# EAGLE design whistle-board (EAGLE 7.4.0)
VERSION: 1.0
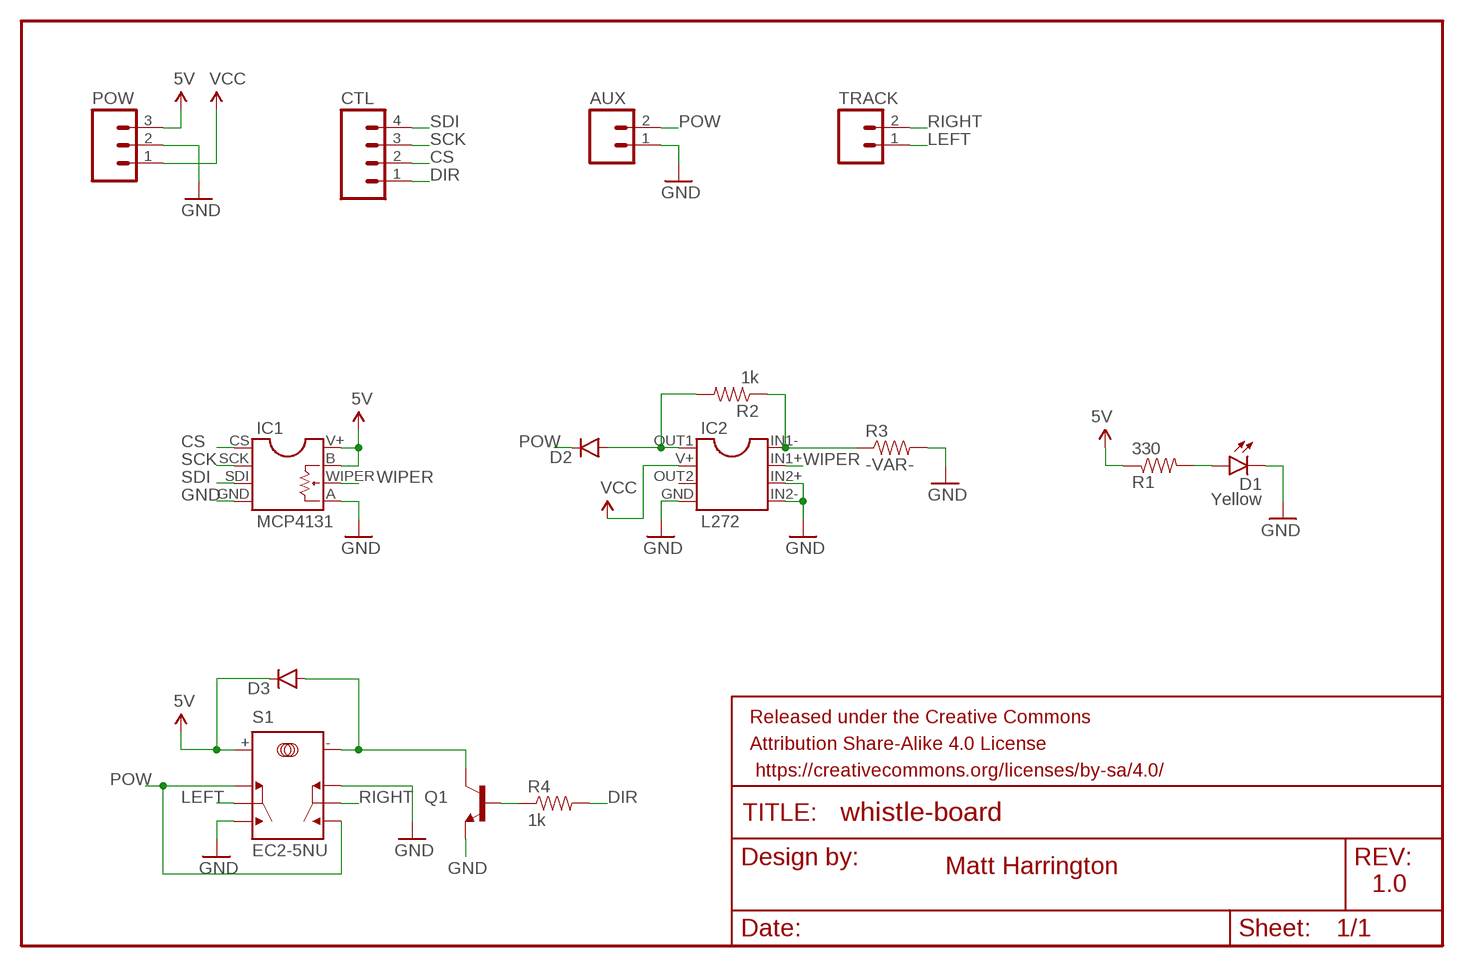
[diagram p0: schematic, sheet 1]

## Parts
AUX  M02PTH  [1X02]
CTL  M04PTH  [1X04]
D1  Yellow  LED-YELLOW0603  [LED-EDGE]
D2  DIODEPTH  [DIODE-1N4001]
D3  DIODE1N4148  [DIODE-1N4148]
FRAME1  FRAME-LETTER  [CREATIVE_COMMONS]
IC1  MCP4131  [MCP4131]
IC2  L272  [L272]
POW  M03PTH  [1X03]
Q1  TRANSISTOR_NPNTO92  [TO-92]
R1  330  1KOHM-1/4W-5%(PTH)  [AXIAL-0.3]
R2  1k  1KOHM-1/4W-5%(PTH)  [AXIAL-0.3]
R3  -VAR-  1KOHM-1/4W-5%(PTH)  [AXIAL-0.3]
R4  1k  1KOHM-1/4W-5%(PTH)  [AXIAL-0.3]
S1  EC2-5NU  [EC2-5NU]
TRACK  M02PTH  [1X02]

## Nets
5V: D3.C IC1.B IC1.V+ POW.3 R1.P$1 S1.+
CS: CTL.2 IC1.CS
DIR: CTL.1 R4.P$2
GND: AUX.1 D1.C IC1.A IC1.GND IC2.GND IC2.IN2+ IC2.IN2- POW.2 Q1.1(E) R3.P$2 S1.NC2 S1.NO1
LEFT: S1.COM1 TRACK.1
N$1: D3.A Q1.3(C) S1.-
N$2: Q1.2(B) R4.P$1
N$3: IC2.IN1- R2.P$1 R3.P$1
N$5: D2.A IC2.OUT1 R2.P$2
N$19: D1.A R1.P$2
POW: AUX.2 D2.C S1.NC1 S1.NO2
RIGHT: S1.COM2 TRACK.2
SCK: CTL.3 IC1.SCK
SDI: CTL.4 IC1.SDI
VCC: IC2.V+ POW.1
WIPER: IC1.WIPER IC2.IN1+
Unconnected: IC2.OUT2

## Notes on the sheet
- Matt Harrington
- 1.0

## Library data of the parts
AUX TRACK = SparkFun-Connectors:M02: Standard 2-pin 0.1" header. Use with - straight break away headers ( PRT-00116) - right angle break away headers (PRT-00553) - swiss pins (PRT-00743) - machine pins (PRT-00117) - female headers (PRT-00115) Molex polarized connector foot print use with: PRT-08233 with associated crimp pins and housings. 2.54_SCREWTERM for use with PRT-10571. 3.5mm Screw Terminal footprints for PRT-08084 5mm Screw Terminal footprints for use with PRT-08432
CTL = SparkFun-Connectors:M04: Header 4 Standard 4-pin 0.1" header. Use with straight break away headers (SKU : PRT-00116), right angle break away headers (PRT-00553), swiss pins (PRT-00743), machine pins (PRT-00117), and female headers (PRT-00115). Molex polarized connector foot print use with SKU : PRT-08231 with associated crimp pins and housings. 1MM SMD Version SKU: PRT-10208
D1 = custom-parts:LED-YELLOW: Yellow SMD LEDs LilyPad 1206- DIO-09909 0603- DIO-09003 "SMART" means more efficient and expensive; PROD_ID: DIO-09003
D2 D3 = SparkFun-DiscreteSemi:DIODE: Diode These are standard reverse protection diodes and small signal diodes. SMA package can handle up to about 1A. SOD-323 can handle about 200mA. What the SOD-323 package when ordering, there are some mfgs out there that are 5-pin packages.
FRAME1 = SparkFun-Aesthetics:FRAME-LETTER: Schematic Frame Standard 8.5x11 US Letter frame
IC1 = custom-parts:MCP4131
IC2 = custom-parts:L272
POW = SparkFun-Connectors:M03: Header 3 Standard 3-pin 0.1" header. Use with straight break away headers (SKU : PRT-00116), right angle break away headers (PRT-00553), swiss pins (PRT-00743), machine pins (PRT-00117), and female headers (PRT-00115). Molex polarized connector foot print use with SKU : PRT-08232 with associated crimp pins and housings.
Q1 = custom-parts:TRANSISTOR_NPN: Generic NPN BJT MMBT2222A - TRANS-08049 (SOT-23, 1A 40V) MPSA42 - TRANS-09116 (SOT-23, 500mA 300V) MMBT5088LT1G - TRANS-11160 (SOT-23, 50 mA 30V) BC547 - COM-08928 <http://www.sparkfun.com/products/8928> (TO-92 45V 100mA) (1.Collector 2.Base 3.Emitter) 2N3904 - COM-00521 <http://www.sparkfun.com/products/521> (TO-92 40V 200mA) (1.Emitter 2.Base 3.Collector) P2N2222A - COM-12852 <http://www.sparkfun.com/products/12852> (TO-92 40V 600mA) (1.Collector 2.Base 3.Emitter)
R1-R4 = SparkFun-Resistors:1KOHM-1/4W-5%(PTH): RES-08380; PROD_ID: RES-08380; VALE: 1k
S1 = custom-parts:EC2-5NU

## Board
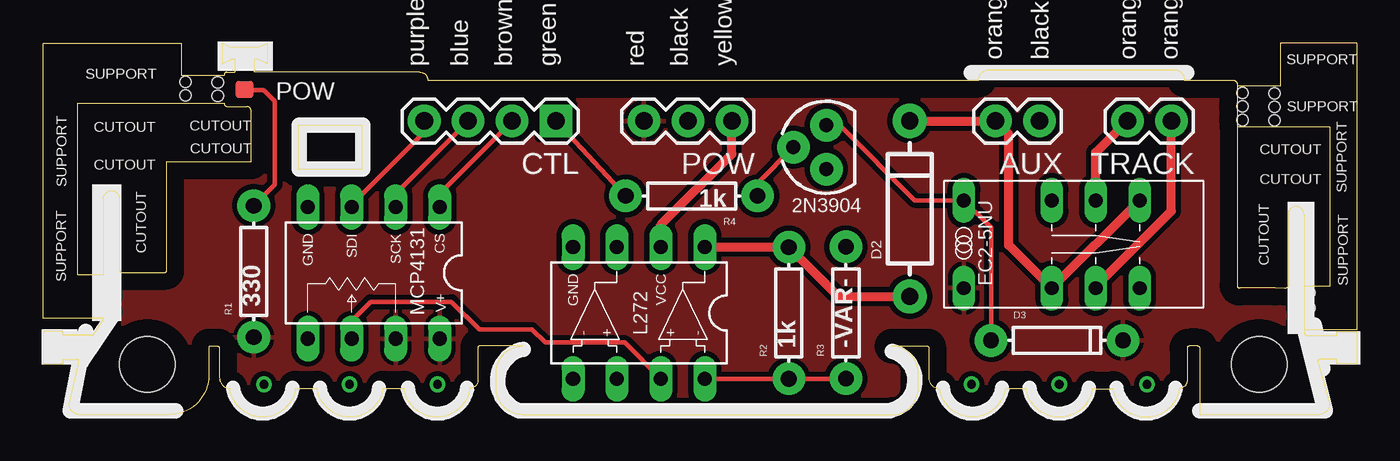
[diagram p1: board, top side]
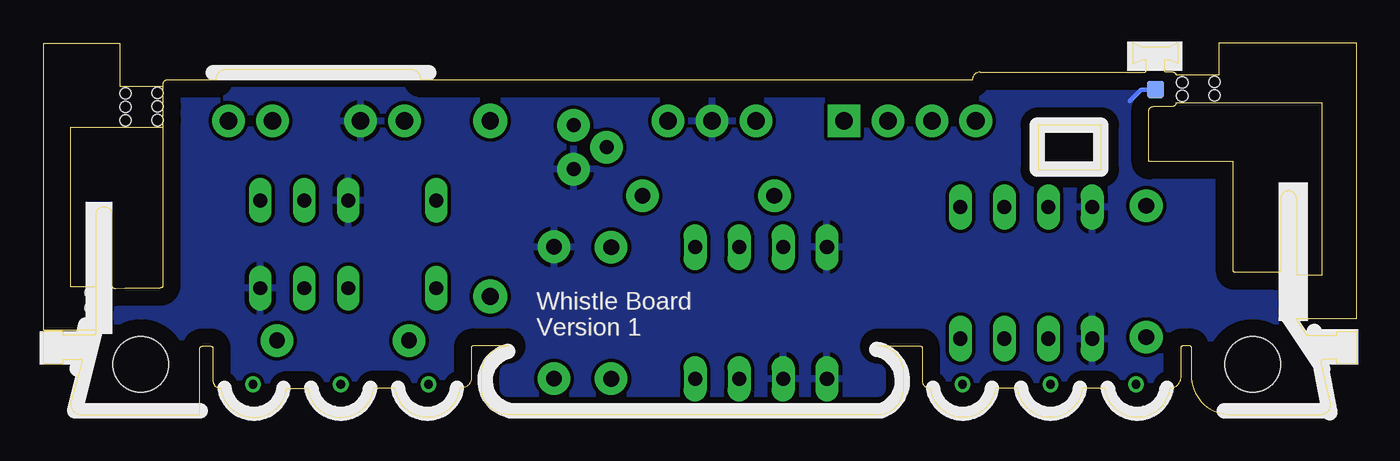
[diagram p2: board, bottom side, seen from below]

Size 75.92 x 21.65 mm. Coordinates in mm from the lower left corner, seen from the top.
Outline: 69.01,19.16 69.01,19.26 arc90 68.76,19.52 65.96,19.52 arc90 65.35,20.13 54.69,20.13 arc90 54.08,19.52 22.22,19.52 arc90 21.77,19.97 12.25,19.97 arc-90 12.19,20.03 12.19,20.67 arc-90 12.23,20.71 12.43,20.71 12.89,20.48 arc117 12.94,20.52 12.94,21.63 arc117 12.92,21.65 12.43,21.41 10.85,21.41 10.38,21.64 arc117 10.34,21.62 10.34,20.51 arc117 10.39,20.48 10.85,20.71 11.06,20.71 arc-90 11.1,20.67 11.1,20.03 arc-90 11.04,19.97 10.61,19.97 arc90 10.46,19.82 10.46,19.8 7.98,19.8 7.98,21.65 0,21.65 0,5.72 3.48,5.72 3.48,5.65
Outline: 69.01,19.16 69.01,16.8
Outline: 69.01,16.8 69.01,7.63 arc90 69.16,7.48 71.2,7.48 71.74,7.47 arc101 71.96,7.65 71.96,11.74 arc-90 72.42,12.2 arc-90 72.87,11.74 72.87,7.58
Outline: 73.66,3.23 74.35,0.77 arc-90 73.74,0.16 66.88,0.16 66.88,3.96 arc90 66.72,4.12 66.23,4.12 arc90 66.12,4.01 66.12,2.14 arc-90 65.66,1.68
Outline: 3.48,5.66 arc-34 3.47,5.63 2.91,4.8 arc-56 2.79,4.73 1.17,4.73 arc-90 1.14,4.76 1.14,4.9 arc90 1.09,4.96 0.06,4.96 arc90 0,4.9 0,3.16 arc90 0.06,3.11 1.09,3.11 arc90 1.14,3.16 1.14,3.33 arc-90 1.18,3.36 1.91,3.36 arc-103 2.06,3.16 1.5,0.77 arc90 2.11,0.16 7.29,0.16 arc90 9.58,2.45 9.58,4.07 arc-90 9.63,4.12 10.07,4.12 arc-90 10.19,4.01 10.19,2.29 arc90 10.79,1.68
Outline: 14.58,1.68 15.82,1.68
Outline: 19.63,1.68 20.85,1.68
Outline: 24.66,1.68 arc90 25.12,2.14 25.12,4.05 arc-90 25.19,4.12 27.71,4.12 arc90 26.19,2.6 26.19,1.68 arc90 27.71,0.16 49.05,0.16 arc90 50.57,1.68 50.57,2.6 arc90 49.05,4.12 51.11,4.12 arc-90 51.18,4.05 51.18,2.29 arc90 51.79,1.68
Outline: 55.6,1.68 56.82,1.68
Outline: 60.63,1.66 61.85,1.66
Outline: 14.58,1.68 arc-165 10.78,1.68
Outline: 19.63,1.68 arc-165 15.83,1.68
Outline: 24.66,1.68 arc-165 20.86,1.68
Outline: 55.6,1.68 arc-165 51.81,1.68
Outline: 60.63,1.66 arc-165 56.82,1.68
Outline: 65.66,1.68 arc-165 61.84,1.66
Outline: 72.87,7.58 72.87,5.06
Outline: 72.87,5.06 72.87,4.94 arc90 73.08,4.73 73.13,4.73 74.75,4.73 arc90 74.78,4.76 74.78,4.9 arc-90 74.83,4.96 75.86,4.96 arc-90 75.92,4.9 75.92,3.16 arc-90 75.86,3.11 74.83,3.11 arc-90 74.78,3.16 74.78,3.33 arc90 74.74,3.36 73.79,3.36 arc90 73.66,3.23
Outline: 72.87,7.58 74.35,7.58 74.35,16.8 69.01,16.8
Outline: 72.87,5.06 75.92,5.06 75.92,21.65 71.5,21.65 71.5,19.16 69.01,19.16
Outline: 3.48,12.66 arc-90 3.94,13.11 arc-90 4.39,12.66 4.39,8.56 arc101 4.61,8.38 5.16,8.39 7.04,8.39 arc90 7.14,8.49 7.14,14.79 12.01,14.79 12.01,17.74 arc90 11.76,17.99 10.63,17.99 arc-90 10.46,18.15 10.46,18.19 2.01,18.19 2.01,8.24 3.48,8.24 3.48,12.66
Outline: 14.76,16.92 18.41,16.92 18.41,14.33 14.76,14.33 14.76,16.92
Copper layers (1*16): Top 0.035mm / dielectric 1.5mm / Bottom 0.035mm
Design rules "default": minimum track width 10mil, minimum drill 24mil, track to track 8mil, track to pad 8mil, pad to pad 8mil, via to via 8mil, smd to smd 8mil, copper to edge 40mil, drill to drill 8mil, minimum pad ring 10mil, minimum via ring 8mil, stop-mask expansion 4mil, vias tented up to drill 0mil, thermal gap 10mil
Holes 3.2 mm at 70.28,3.06 6.02,3.06
Holes 0.64 mm at 3.23,7.88 3.23,6.99 3.23,6.1 10.08,19.39 10.08,18.6 8.23,19.41 8.23,18.63 73.18,7.22 73.18,6.33 73.18,5.44 71.17,18.75 71.17,17.97 69.32,18.78 69.32,17.99 71.17,17.18 69.32,17.2

### Footprints (pad centres in the part's own frame; a part is rotated, then mirrored left to right if it is on the bottom)
1X02 = drill 1.016 pad 1.88: 1 0,0; 2 2.54,0
1X04 = drill 1.016 pad 1.88 square: 1 0,0 | drill 1.016 pad 1.88: 2 2.54,0; 3 5.08,0; 4 7.62,0
LED-EDGE = smd 1 x 1 bottom: A 0,0.012 | smd 1 x 1: C 0,0.013
DIODE-1N4001 = drill 1 pad 1.981: A -5.08,0; C 5.08,0
DIODE-1N4148 = drill 0.9 pad 1.88: A -3.81,0; C 3.81,0
MCP4131 = drill 0.813 long: A 3.81,3.81; B -1.27,3.81; CS -3.81,-3.81; GND 3.81,-3.81; SCK -1.27,-3.81; SDI 1.27,-3.81; V+ -3.81,3.81; WIPER 1.27,3.81
L272 = drill 0.813 long: GND 3.81,-3.81; IN1+ -1.27,3.81; IN1- -3.81,3.81; IN2+ 1.27,3.81; IN2- 3.81,3.81; OUT1 -3.81,-3.81; OUT2 1.27,-3.81; V+ -1.27,-3.81
1X03 = drill 1.016 pad 1.88: 1 0,0; 2 2.54,0; 3 5.08,0
TO-92 = drill 0.813 pad 1.88: 1 -1.27,0; 2 0,1.905; 3 1.27,0
AXIAL-0.3 = drill 0.9 pad 1.88: P$1 -3.81,0; P$2 3.81,0
EC2-5NU = drill 0.8 long: + -6.35,-2.54; - -6.35,2.54; COM1 1.27,-2.54; COM2 1.27,2.54; NC1 -1.27,-2.54; NC2 -1.27,2.54; NO1 3.81,-2.54; NO2 3.81,2.54

### Placement (x,y rotation side)
AUX  57.58,17.15 180 top
CTL  29.64,17.15 180 top
D1  11.63,18.96 0 bottom
D2  50.09,12.07 90 top
D3  58.6,4.45 0 top
FRAME1  20.85,-7.66 0 top  (outside the outline)
IC1  19.1,8.37 180 top
IC2  34.43,6.04 180 top
POW  39.8,17.15 180 top
Q1  45.26,15.63 90 top
R1  12.17,8.44 90 top
R2  43.09,6.04 90 top
R3  46.39,6.05 90 top
R4  37.48,12.81 180 top
S1  59.56,10.02 0 top
TRACK  65.2,17.15 180 top

### Tracks (layer width: path | path; a pad name or v marks a point on that pad's centre or on a via)
5V
  pour Top (isolate 0.305): 0.46,21.85 75.84,21.85 75.84,0.01 0.38,0.14 0.38,21.83 0.58,21.83
CS
  Top 0.254: IC1.CS 22.91,12.96 CTL.2
DIR
  Top 0.254: CTL.1 29.65,17.15 R4.P$2
GND
  Bottom 0.254: D1.C 12.46,18.97 13.13,18.3
  pour Bottom: 0.43,0.01 0.43,21.6 61.39,21.6 76.63,21.6 76.63,0.01
LEFT
  Top 0.406: S1.COM1 60.83,7.58
  Top 0.508: 60.83,7.58 64.69,11.44 65.2,11.95 TRACK.1
N$1
  Top 0.254: Q1.3 46.02,16.9 50.37,12.56 S1.- 54.79,10.98 D3.A
N$2
  Top 0.254: R4.P$1 41.31,13.58 Q1.2
N$3
  Top 0.254: IC2.IN1- R2.P$1 43.1,2.24 R3.P$1
N$5
  Top 0.508: IC2.OUT1 R2.P$2 45.95,6.99 D2.A
N$8  (via drill 0.5)
  other vias: 12.75,1.91
N$9  (via drill 0.5)
  other vias: 17.7,1.91
N$10  (via drill 0.5)
  other vias: 22.78,1.91
N$11  (via drill 0.5)
  other vias: 53.64,1.91
N$12  (via drill 0.5)
  other vias: 58.72,1.91
N$13  (via drill 0.5)
  other vias: 63.8,1.91
N$19
  Top 0.254: R1.P$2 13.39,13.47 13.39,18.3 12.75,18.93 11.67,18.93 D1.A
POW
  Top 0.508: S1.NO2 S1.NC1 55.8,9.97 55.8,16.39 AUX.2 D2.C
RIGHT
  Top 0.508: S1.COM2 60.83,15.32 TRACK.2
SCK
  Top 0.254: IC1.SCK 20.37,12.96 CTL.3
SDI
  Top 0.254: IC1.SDI 17.83,12.33 22.02,16.52 CTL.4
VCC
  Top 0.508: IC2.V+ 35.7,11.15 39.8,15.25 POW.1
WIPER
  Top 0.254: IC1.WIPER 17.83,5.6 18.92,6.69 23.6,6.69 25.2,5.09 28.24,5.09 29.01,4.33 33.6,4.33 IC2.IN1+

### Text on the board
tPlace: SUPPORT | SUPPORT | POW | SUPPORT | CUTOUT | CUTOUT | CUTOUT | CUTOUT | CUTOUT | SUPPORT | CUTOUT | SUPPORT | 2N3904 | CUTOUT | CUTOUT | SUPPORT | EC2-5NU | SUPPORT | MCP4131 | L272
bPlace: Whistle Board / Version 1
tNames: orange | black | orange | orange | purple | blue | brown | green | red | black | yellow